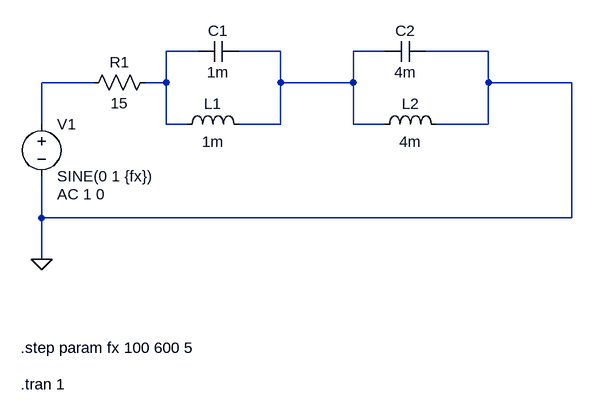
[diagram p0: schematic parallel-lc-3.asc]
parallel-lc-3.asc, the LTspice schematic file:
Version 4.1
SHEET 1 880 680
WIRE 0 16 -48 16
WIRE 128 16 64 16
WIRE 288 16 240 16
WIRE 448 16 352 16
WIRE -160 64 -240 64
WIRE -48 64 -48 16
WIRE -48 64 -80 64
WIRE 128 64 128 16
WIRE 240 64 240 16
WIRE 240 64 128 64
WIRE 448 64 448 16
WIRE 576 64 448 64
WIRE -240 128 -240 64
WIRE -48 128 -48 64
WIRE -16 128 -48 128
WIRE 128 128 128 64
WIRE 128 128 64 128
WIRE 240 128 240 64
WIRE 288 128 240 128
WIRE 448 128 448 64
WIRE 448 128 368 128
WIRE -240 272 -240 208
WIRE 576 272 576 64
WIRE 576 272 -240 272
WIRE -240 336 -240 272
FLAG -240 336 0
SYMBOL voltage -240 112 R0
WINDOW 123 24 124 Left 2
WINDOW 39 0 0 Left 0
SYMATTR Value2 AC 1 0
SYMATTR InstName V1
SYMATTR Value SINE(0 1 {fx})
SYMBOL res -64 48 R90
WINDOW 0 0 56 VBottom 2
WINDOW 3 32 56 VTop 2
SYMATTR InstName R1
SYMATTR Value 15
SYMBOL cap 64 0 R90
WINDOW 0 0 32 VBottom 2
WINDOW 3 32 32 VTop 2
SYMATTR InstName C1
SYMATTR Value 1m
SYMBOL cap 352 0 R90
WINDOW 0 0 32 VBottom 2
WINDOW 3 32 32 VTop 2
SYMATTR InstName C2
SYMATTR Value 4m
SYMBOL ind -32 144 R270
WINDOW 0 32 56 VTop 2
WINDOW 3 5 56 VBottom 2
SYMATTR InstName L1
SYMATTR Value 1m
SYMBOL ind 272 144 R270
WINDOW 0 32 56 VTop 2
WINDOW 3 5 56 VBottom 2
SYMATTR InstName L2
SYMATTR Value 4m
TEXT -272 472 Left 2 !.step param fx 100 600 5
TEXT -272 528 Left 2 !.tran 1

The netlist it stands for:
* parallel-lc-3.asc
V1 N003 0 SINE(0 1 {fx}) AC 1 0
R1 N001 N003 15
C1 N002 N001 1m
C2 0 N002 4m
L1 N001 N002 1m
L2 N002 0 4m
.step param fx 100 600 5
.tran 1
.backanno
.end